# EAGLE schematic MAX485-Schematic (EAGLE 6.3)
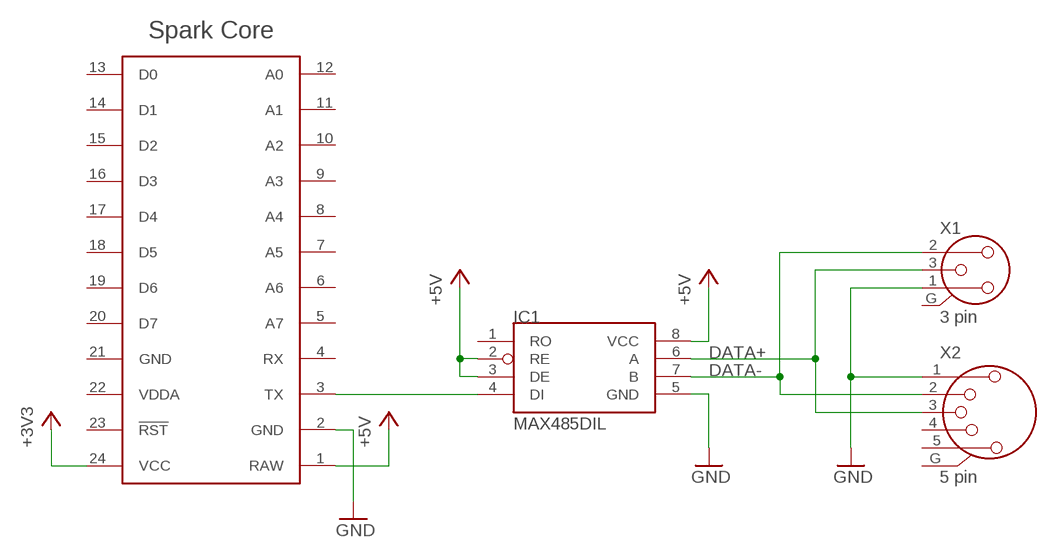
[diagram p0: schematic, sheet 1]

## Parts
IC1  MAX485DIL  [DIL08]
U$1  SPARK_SPARK_CORECORE  [SPARK_SPARK_CORE]
X1  3 pin  NC3FAH2  [NC3FAH2]
X2  5 pin  NC5FAH  [NC5FAH]

## Nets
+3V3: U$1.24(VCC)
+5V: IC1.2(RE) IC1.3(DE) IC1.8(VCC) U$1.1(RAW)
DATA+: IC1.6(A) X1.3 X2.3
DATA-: IC1.7(B) X1.2 X2.2
GND: IC1.5(GND) U$1.2(GND) X1.1 X2.1
N$3: IC1.4(DI) U$1.3(TX)
Unconnected: IC1.1(RO) U$1.4(RX) U$1.5(A7) U$1.6(A6) U$1.7(A5) U$1.8(A4) U$1.9(A3) U$1.10(A2) U$1.11(A1) U$1.12(A0) U$1.13(D0) U$1.14(D1) U$1.15(D2) U$1.16(D3) U$1.17(D4) U$1.18(D5) U$1.19(D6) U$1.20(D7) U$1.23(!RST) X1.G X2.4 X2.5 X2.G

## Notes on the sheet
- Spark Core

## Power pins joined to a net without a drawn wire
GND: U$1.21(GND)
VDDA: U$1.22(VDDA)

## Library data of the parts
IC1 = humm:MAX485: RS-485 transceiver
U$1 = humm:SPARK_SPARK_CORE
X1 = con-neutrik_ag:NC3: Neutrik Audio Connector XLR SERIES Stereo 1/4" jack Source: www.neutrik.com/; MPN: NC3FAH2; OC_FARNELL: unknown; OC_NEWARK: 27B4208
X2 = con-neutrik_ag:NC5: Neutrik Audio Connector XLR SERIES Stereo 1/4" jack Source: www.neutrik.com/; MF: FARNELL; MPN: NC5FAH; OC_FARNELL: 8020418; OC_NEWARK: 38K6010